# EAGLE design Shield (EAGLE 9.3.0)
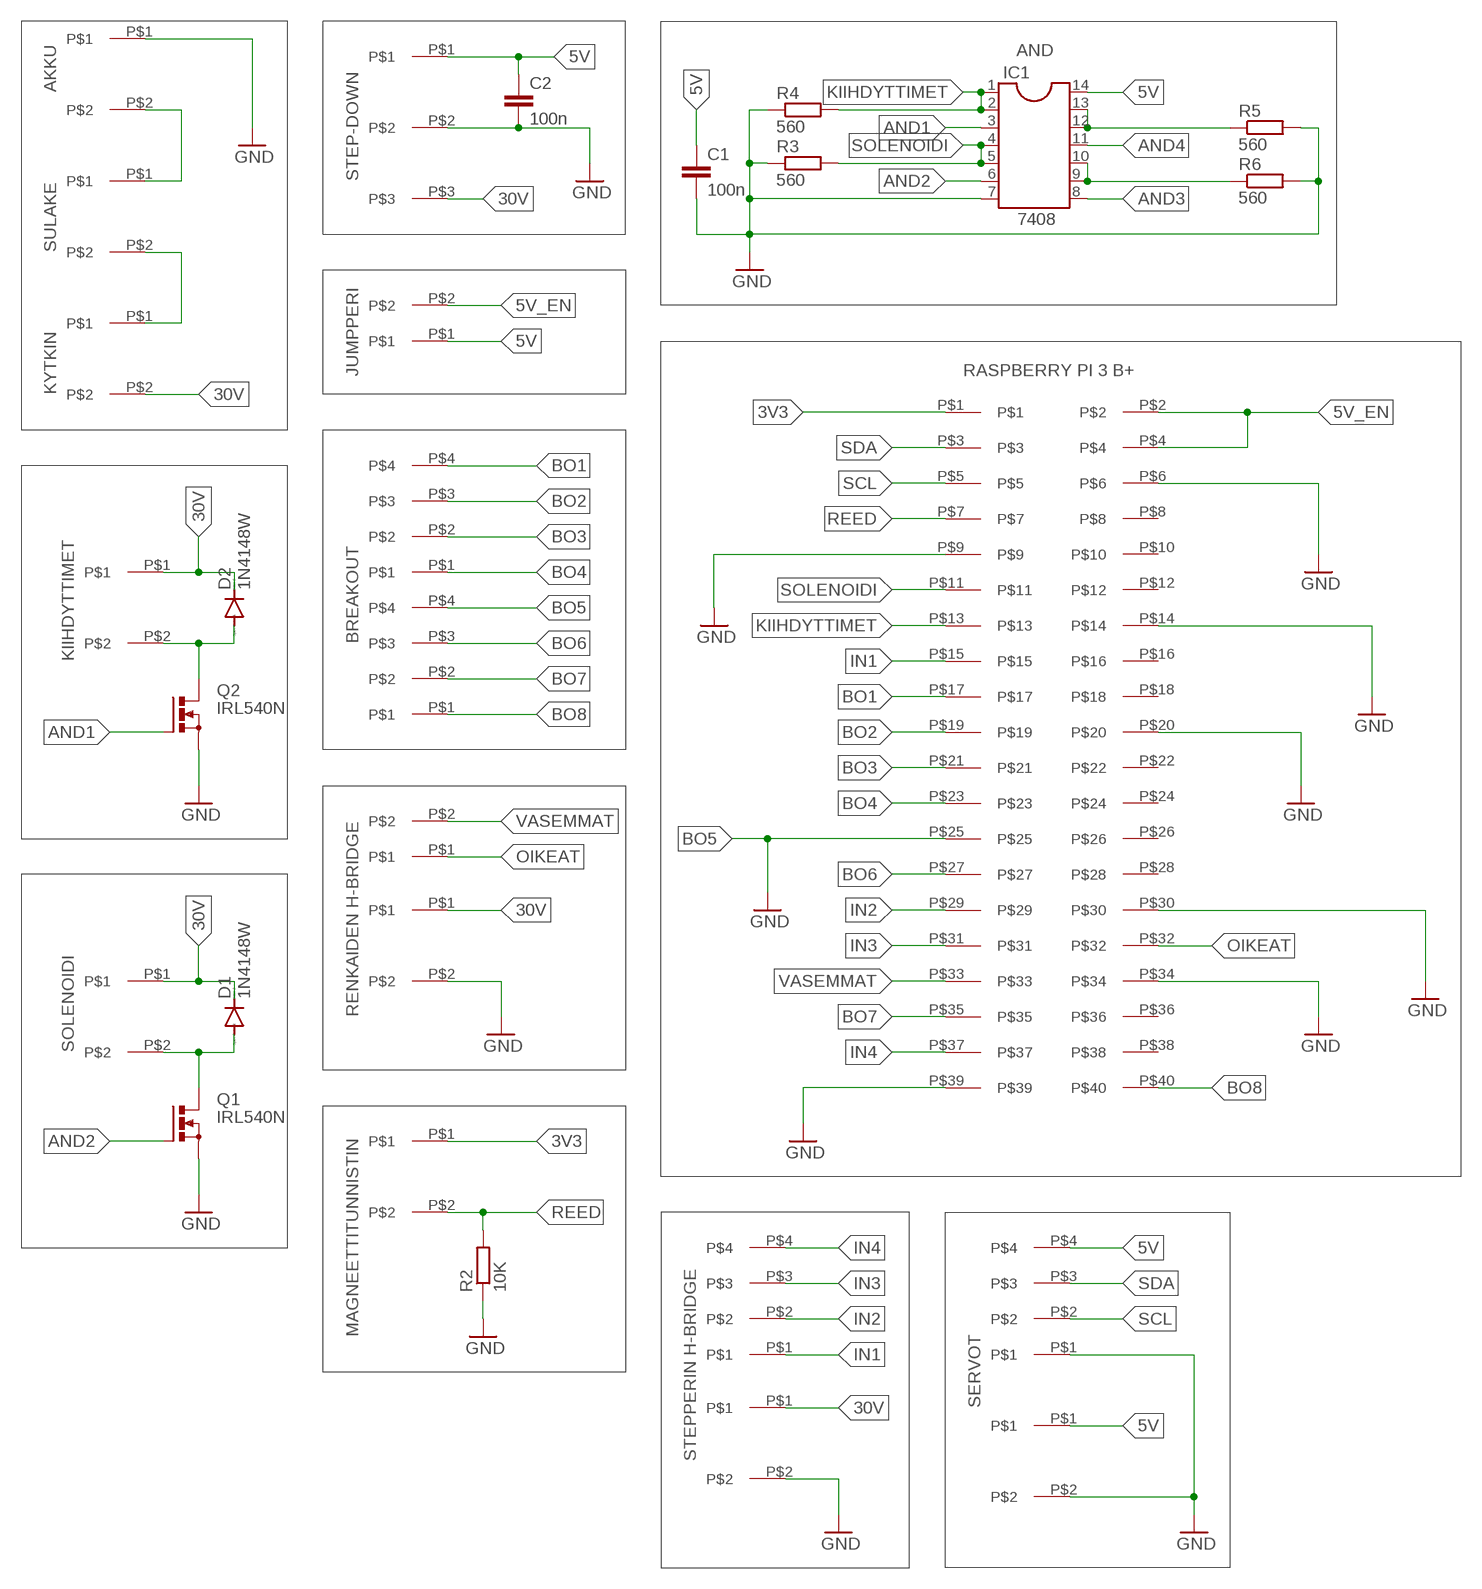
[diagram p0: schematic, sheet 1]

## Parts
AKKU  AKKU  2PIN  [2PIN]
C1  100n  C-EUC1206  [C1206]
C2  100n  C-EUC1206  [C1206]
D1  1N4148W  CGRM4001-G  [SOD-123_MINI-SMA]
D2  1N4148W  CGRM4001-G  [SOD-123_MINI-SMA]
IC1  7408  DIL14  [DIL14]
Q1  IRL540N  PMOSFET_NTO220BH  [TO220BH]
Q2  IRL540N  PMOSFET_NTO220BH  [TO220BH]
R2  10K  R-EU_M1206  [M1206]
R3  560  R-EU_M1206  [M1206]
R4  560  R-EU_M1206  [M1206]
R5  560  R-EU_M1206  [M1206]
R6  560  R-EU_M1206  [M1206]
U$1  KIIHDYTTIMET  2PIN  [2PIN]
U$2  SOLENOIDI  2PIN  [2PIN]
U$3  2.54_4PIN  [2.54_4PIN]
U$4  SULAKE  2PIN  [2PIN]
U$5  KYTKIN  2PIN  [2PIN]
U$6  REED  2PIN  [2PIN]
U$7  STEP-DOWN  3PIN  [3PIN]
U$8  STEPPER  2PIN  [2PIN]
U$9  RENKAAT  2PIN  [2PIN]
U$10  2.54_2PIN2PIN  [2.54_2PIN]
U$11  2.54_2PIN2PIN  [2.54_2PIN]
U$12  SERVO  2.54_4PIN  [2.54_4PIN]
U$13  SERVO  2PIN  [2PIN]
U$14  PI3  [PI3]
U$15  SERVO  2.54_4PIN  [2.54_4PIN]
U$16  SERVO  2.54_4PIN  [2.54_4PIN]

## Nets
3V3: U$6.P$1 U$14.P$1
5V: C1.1 C2.1 IC1.14 U$7.P$1 U$11.P$1 U$12.P$4 U$13.P$1
5V_EN: U$11.P$2 U$14.P$2 U$14.P$4
30V: D1.C D2.C U$1.P$1 U$2.P$1 U$5.P$2 U$7.P$3 U$8.P$1 U$9.P$1
AND1: IC1.3 Q2.G
AND2: IC1.6 Q1.G
AND3: IC1.8
AND4: IC1.11
BO1: U$14.P$17 U$15.P$4
BO2: U$14.P$19 U$15.P$3
BO3: U$14.P$21 U$15.P$2
BO4: U$14.P$23 U$15.P$1
BO5: U$14.P$25 U$16.P$4 ; supply symbol labelled GND
BO6: U$14.P$27 U$16.P$3
BO7: U$14.P$35 U$16.P$2
BO8: U$14.P$40 U$16.P$1
GND: AKKU.P$1 C1.2 C2.2 IC1.7 Q1.S Q2.S R2.1 R3.1 R4.1 R5.2 R6.2 U$7.P$2 U$8.P$2 U$9.P$2 U$12.P$1 U$13.P$2 U$14.P$6 U$14.P$9 U$14.P$14 U$14.P$20 U$14.P$30 U$14.P$34 U$14.P$39
IN1: U$3.P$1 U$14.P$15
IN2: U$3.P$2 U$14.P$29
IN3: U$3.P$3 U$14.P$31
IN4: U$3.P$4 U$14.P$37
KIIHDYTTIMET: IC1.1 IC1.2 R4.2 U$14.P$13
N$1: D2.A Q2.D U$1.P$2
N$3: IC1.9 IC1.10 R6.1
N$4: IC1.12 IC1.13 R5.1
N$5: D1.A Q1.D U$2.P$2
N$9: AKKU.P$2 U$4.P$1
N$10: U$4.P$2 U$5.P$1
OIKEAT: U$10.P$1 U$14.P$32
REED: R2.2 U$6.P$2 U$14.P$7
SCL: U$12.P$2 U$14.P$5
SDA: U$12.P$3 U$14.P$3
SOLENOIDI: IC1.4 IC1.5 R3.2 U$14.P$11
VASEMMAT: U$10.P$2 U$14.P$33
Unconnected: U$14.P$8 U$14.P$10 U$14.P$12 U$14.P$16 U$14.P$18 U$14.P$22 U$14.P$24 U$14.P$26 U$14.P$28 U$14.P$36 U$14.P$38

## Notes on the sheet
- AND
- AKKU
- STEP-DOWN
- SULAKE
- JUMPPERI | RASPBERRY PI 3 B+
- KYTKIN
- BREAKOUT
- KIIHDYTTIMET
- RENKAIDEN H-BRIDGE
- SOLENOIDI
- MAGNEETTITUNNISTIN
- SERVOT
- STEPPERIN H-BRIDGE

## Library data of the parts
AKKU U$1 U$2 U$4-U$6 U$8 U$9 U$13 = PI3:2PIN
C1 C2 = rcl:C-EU: CAPACITOR, European symbol; SPICEPREFIX: C
D1 D2 = diode:CGRM400*-G: Molded plasitc,JEDEC SOD-123/Mini SMA Source: Comchip CGRM4001-G.pdf
IC1 = ic-package:DIL14: Dual In Line / Socket
Q1 Q2 = transistor-power:PMOSFET_N: Power MOSFET N-Channel
R2-R6 = rcl:R-EU_: RESISTOR, European symbol; SPICEPREFIX: R
U$3 U$12 U$15 U$16 = PI3:2.54_4PIN
U$7 = PI3:3PIN
U$10 U$11 = PI3:2.54_2PIN
U$14 = PI3:PI3

## Net classes
1 30V: width 2.54 mm

## Board
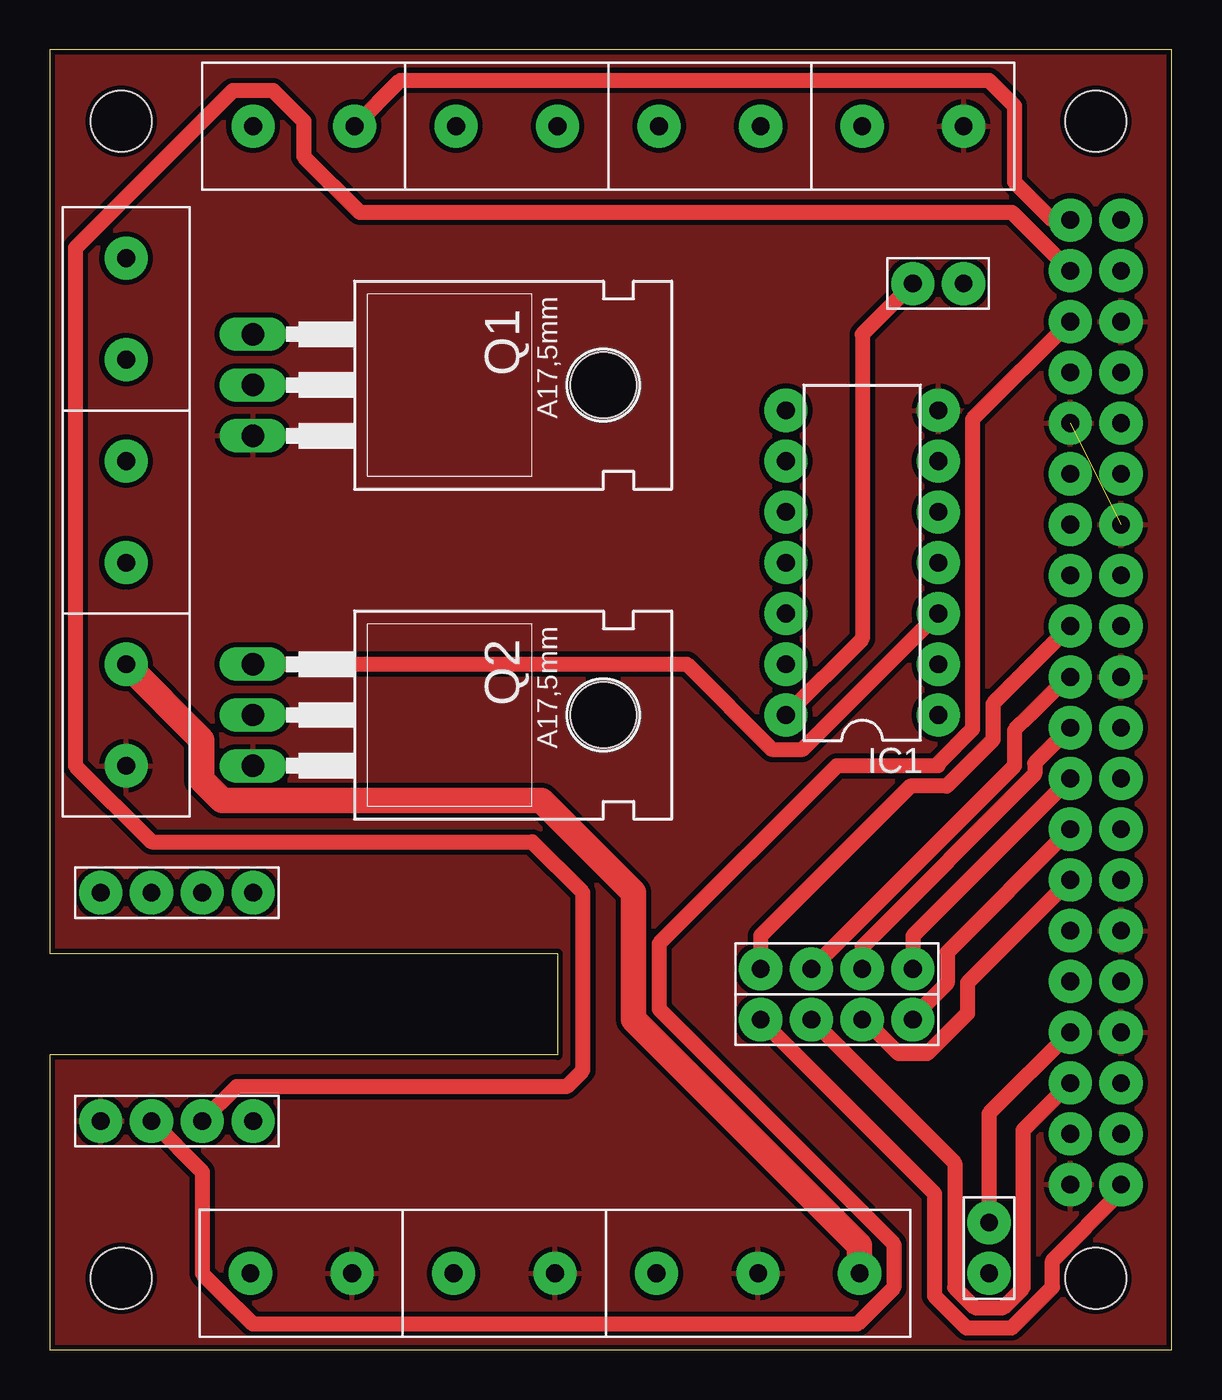
[diagram p1: board, top side]
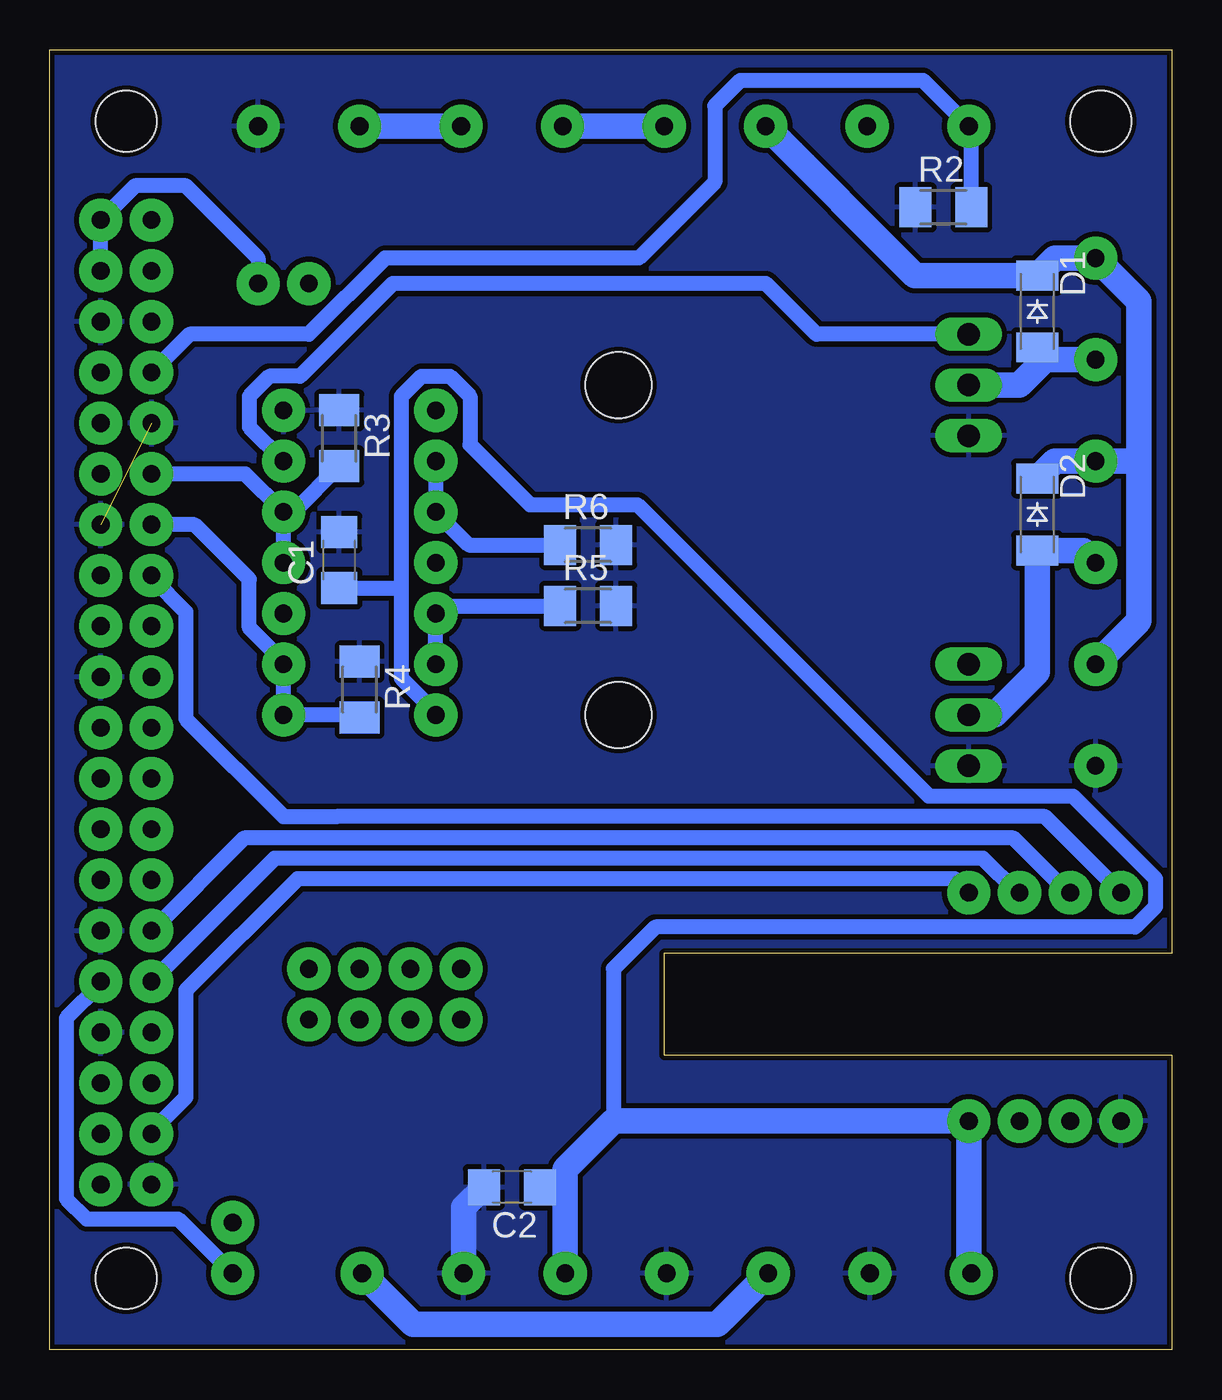
[diagram p2: board, bottom side, seen from below]

Size 56.13 x 65.02 mm. Coordinates in mm from the lower left corner, seen from the top.
Outline: 0,0 56.13,0 56.13,65.02 0,65.02 0,19.81 25.4,19.81 25.4,14.73 0,14.73 0,0
Copper layers (1*16): Top 0.035mm / dielectric 1.5mm / Bottom 0.035mm
Design rules "default *": minimum track width 30mil, minimum drill 0.35mm, track to track 10mil, track to pad 10mil, pad to pad 10mil, via to via 10mil, smd to smd 10mil, copper to edge 10mil, drill to drill 6mil, minimum pad ring 10mil, minimum via ring 8mil, stop-mask expansion 4mil, vias tented up to drill 0mil, thermal gap 10mil
Holes 3.05 mm at 3.56,61.47 52.32,61.47 52.32,3.56 3.56,3.56

### Footprints (pad centres in the part's own frame; a part is rotated, then mirrored left to right if it is on the bottom)
2PIN = drill 0.889 pad 2.159: P$1 0,0; P$2 5.08,0
C1206 = smd 1.6 x 1.8: 1 -1.4,0; 2 1.4,0
SOD-123_MINI-SMA = smd 1.5 x 2.1: A 1.8,0; C -1.8,0
DIL14 = drill 0.889 pad 2.159: 1 -7.62,-3.81; 2 -5.08,-3.81; 3 -2.54,-3.81; 4 0,-3.81; 5 2.54,-3.81; 6 5.08,-3.81; 7 7.62,-3.81; 8 7.62,3.81; 9 5.08,3.81; 10 2.54,3.81; 11 0,3.81; 12 -2.54,3.81; 13 -5.08,3.81; 14 -7.62,3.81
TO220BH = drill 1.118 long: D 0,-6.35; G -2.54,-6.35; S 2.54,-6.35 | hole 3.302: 0,11.176
M1206 = smd 1.6 x 2: 1 -1.4,0; 2 1.4,0
2.54_4PIN = drill 0.889 pad 2.159: P$1 0,0; P$2 0,-2.54; P$3 0,-5.08; P$4 0,-7.62
3PIN = drill 0.889 pad 2.159: P$1 0,0; P$2 5.08,0; P$3 10.16,0
2.54_2PIN = drill 0.889 pad 2.159: P$1 0,0; P$2 0,-2.54
PI3 = drill 0.889 pad 2.159: P$1 0,0; P$2 2.54,0; P$3 0,-2.54; P$4 2.54,-2.54; P$5 0,-5.08; P$6 2.54,-5.08; P$7 0,-7.62; P$8 2.54,-7.62; P$9 0,-10.16; P$10 2.54,-10.16; P$11 0,-12.7; P$12 2.54,-12.7; P$13 0,-15.24; P$14 2.54,-15.24; P$15 0,-17.78; P$16 2.54,-17.78; P$17 0,-20.32; P$18 2.54,-20.32; P$19 0,-22.86; P$20 2.54,-22.86; P$21 0,-25.4; P$22 2.54,-25.4; P$23 0,-27.94; P$24 2.54,-27.94; P$25 0,-30.48; P$26 2.54,-30.48; P$27 0,-33.02; P$28 2.54,-33.02; P$29 0,-35.56; P$30 2.54,-35.56; P$31 0,-38.1; P$32 2.54,-38.1; P$33 0,-40.64; P$34 2.54,-40.64; P$35 0,-43.18; P$36 2.54,-43.18; P$37 0,-45.72; P$38 2.54,-45.72; P$39 0,-48.26; P$40 2.54,-48.26

### Placement (x,y rotation side)
AKKU  45.72,61.21 180 top
C1  41.66,39.5 90 bottom
C2  33.02,8.13 180 bottom
D1  6.73,51.94 270 bottom
D2  6.73,41.78 270 bottom
IC1  40.64,39.37 90 top
Q1  16.51,48.26 270 top
Q2  16.51,31.75 270 top
R2  11.43,57.15 0 bottom
R3  41.66,45.59 270 bottom
R4  40.64,33.02 270 bottom
R5  29.21,37.21 0 bottom
R6  29.21,40.26 0 bottom
U$1  3.81,44.45 270 top
U$2  3.81,54.61 270 top
U$3  2.54,22.86 90 top
U$4  35.56,61.21 180 top
U$5  25.4,61.21 180 top
U$6  15.24,61.21 180 top
U$7  30.35,3.81 0 top
U$8  3.81,34.29 270 top
U$9  20.19,3.81 0 top
U$10  46.99,3.81 180 top
U$11  43.18,53.34 90 top
U$12  2.54,11.43 90 top
U$13  10.03,3.81 0 top
U$14  51.05,56.52 0 top
U$15  43.18,19.05 270 top
U$16  35.56,16.51 90 top

### Tracks (layer width: path | path; a pad name or v marks a point on that pad's centre or on a via)
3V3
  Top 0.762: U$6.P$1 17.53,63.5 46.99,63.5 48.26,62.23 48.26,58.42 50.16,56.52 U$14.P$1
5V
  Top 0.762: U$11.P$1 40.64,50.8 40.64,35.56 IC1.14
  Bottom 0.762: IC1.14 36.83,31.86 38.54,33.58 38.54,38.1 | C2.1 30.86,8.13 | 38.54,38.1 38.54,47.7 37.54,48.7 36.12,48.7 35.12,47.7 35.12,45.28 32.12,42.27 26.75,42.27 12.16,27.69 4.94,27.69 0.83,23.57 0.83,22.15 1.83,21.14 25.84,21.14 27.94,19.05 27.94,11.43 | C1.1 38.54,38.1
  Bottom 1.27: U$7.P$1 30.35,7.62 | 30.35,7.62 30.35,9.02 27.94,11.43 U$12.P$4 10.16,3.94 U$13.P$1 | 30.86,8.13 30.35,7.62
5V_EN
  Bottom 0.762: U$11.P$2 45.72,54.61 49.34,58.23 51.88,58.23 U$14.P$2 U$14.P$4
30V
  Top 1.27: U$8.P$1 7.59,30.5 7.59,28.5 8.61,27.48 24.59,27.48 29.21,22.86 29.21,16.51 40.51,5.21 U$7.P$3
  Bottom 1.27: U$5.P$2 12.85,53.74 D1.C 5.86,54.61 U$2.P$1 1.65,52.45 1.65,44.45 | U$8.P$1 1.65,36.45 1.65,44.45 | 1.65,44.45 U$1.P$1 5.86,44.45 D2.C | U$9.P$1 22.73,1.27 37.97,1.27 U$7.P$3
AND1
  Top 0.762: Q2.G 31.86,34.29 36.12,30.04 37.66,30.04 IC1.3
AND2
  Bottom 0.762: Q1.G 17.78,50.8 20.32,53.34 38.99,53.34 43.62,48.7 45.16,48.7 46.16,47.7 46.16,46.16 IC1.6
BO1
  Top 0.762: U$15.P$4 35.56,20.7 43.05,28.19 44.87,28.19 47.18,30.5 47.18,32.32 U$14.P$17
BO2
  Top 0.762: U$14.P$19 50.93,33.66 49.28,32 49.02,31.75 48.26,30.99 48.26,29.21 U$15.P$3
BO3
  Top 0.762: U$14.P$21 49.28,29.34 49.28,28.79 40.64,20.15 U$15.P$2
BO4
  Top 0.762: U$14.P$23 43.18,20.7 U$15.P$1
BO5
  Top 0.762: U$14.P$25 44.9,19.88 44.9,18.34 43.18,16.62 U$16.P$4
BO6
  Top 0.762: U$14.P$27 45.91,18.35 45.91,16.82 43.89,14.8 42.47,14.8 40.76,16.51 U$16.P$3
BO7
  Top 0.762: U$14.P$35 48.7,10.99 48.7,3.1 47.7,2.1 46.28,2.1 45.28,3.1 45.28,9.34 U$16.P$2
BO8
  Top 0.762: U$16.P$1 44.26,7.81 44.26,2.68 45.86,1.08 48.12,1.08 50.16,3.12 50.16,4.45 53.59,7.88 U$14.P$40
GND  (1 unrouted)
  Bottom 1.27: U$7.P$2 35.43,7.12 C2.2
  pour Top (isolate 0.254): -1.27,66.04 57.15,66.04 57.15,-1.27 -1.27,-1.27
  pour Bottom (isolate 0.254): -1.27,66.04 57.15,66.04 57.15,-1.27 -1.27,-1.27
IN1
  Bottom 0.762: U$3.P$1 6.35,26.67 41.8,26.67 44.45,26.67 49.34,31.56 49.34,36.91 51.05,38.62 U$14.P$15
IN2
  Bottom 0.762: U$3.P$2 5.2,22.86 7.93,25.59 46.42,25.59 U$14.P$29
IN3
  Bottom 0.762: U$3.P$3 7.74,22.86 9.45,24.57 44.9,24.57 U$14.P$31
IN4
  Bottom 0.762: U$3.P$4 10.86,23.56 43.75,23.56 49.34,17.97 49.34,12.62 51.05,10.91 U$14.P$37
KIIHDYTTIMET
  Bottom 0.762: R4.2 40.77,31.75 IC1.1 IC1.2 44.45,34.41 46.16,36.12 46.16,38.54 48.9,41.27 U$14.P$13
N$1
  Bottom 1.27: Q2.D 8.89,31.75 6.73,33.91 D2.A 4.42,39.98 U$1.P$2
N$3
  Bottom 0.762: IC1.9 IC1.10 35.18,40.26 R6.1
N$4
  Bottom 0.762: IC1.13 IC1.12 36.45,37.21 R5.1
N$5
  Bottom 1.27: U$2.P$2 6.35,49.53 | 6.35,49.53 7.62,48.26 Q1.D | D1.A 6.35,49.76 6.35,49.53
N$9
  Bottom 1.27: AKKU.P$2 U$4.P$1
N$10
  Bottom 1.27: U$4.P$2 U$5.P$1
OIKEAT
  Bottom 0.762: U$10.P$1 49.72,6.54 54.3,6.54 55.31,7.54 55.31,16.59 53.59,18.3 U$14.P$32
REED
  Bottom 0.762: U$14.P$7 49.15,50.8 43.18,50.8 39.37,54.61 26.67,54.61 22.86,58.42 22.86,62.23 21.59,63.5 12.45,63.5 U$6.P$2 10.03,61.08 R2.2
SCL
  Top 0.762: U$12.P$2 7.62,8.89 7.62,3.8 9.32,2.1 9.34,2.1 10.16,1.27 40.4,1.27 42.23,3.1 42.23,5.29 30.48,17.04 30.48,20.32 39.37,29.21 44.45,29.21 44.45,29.32 46.16,31.04 46.16,46.55 U$14.P$5
SDA
  Top 0.762: U$14.P$3 48.13,56.9 15.49,56.9 12.7,59.69 12.7,61.47 11.18,62.99 9.14,62.99 1.27,55.12 1.27,29.21 5.08,25.4 24.13,25.4 26.67,22.86 26.67,13.97 25.84,13.14 9.34,13.14 U$12.P$3
SOLENOIDI
  Bottom 0.762: IC1.4 IC1.5 | R3.2 43.94,41.91 IC1.5 | IC1.5 46.35,43.81 U$14.P$11
VASEMMAT
  Top 0.762: U$14.P$33 46.99,11.81 U$10.P$2